# EAGLE schematic GEVCU-6-2c (EAGLE 6.6.0)
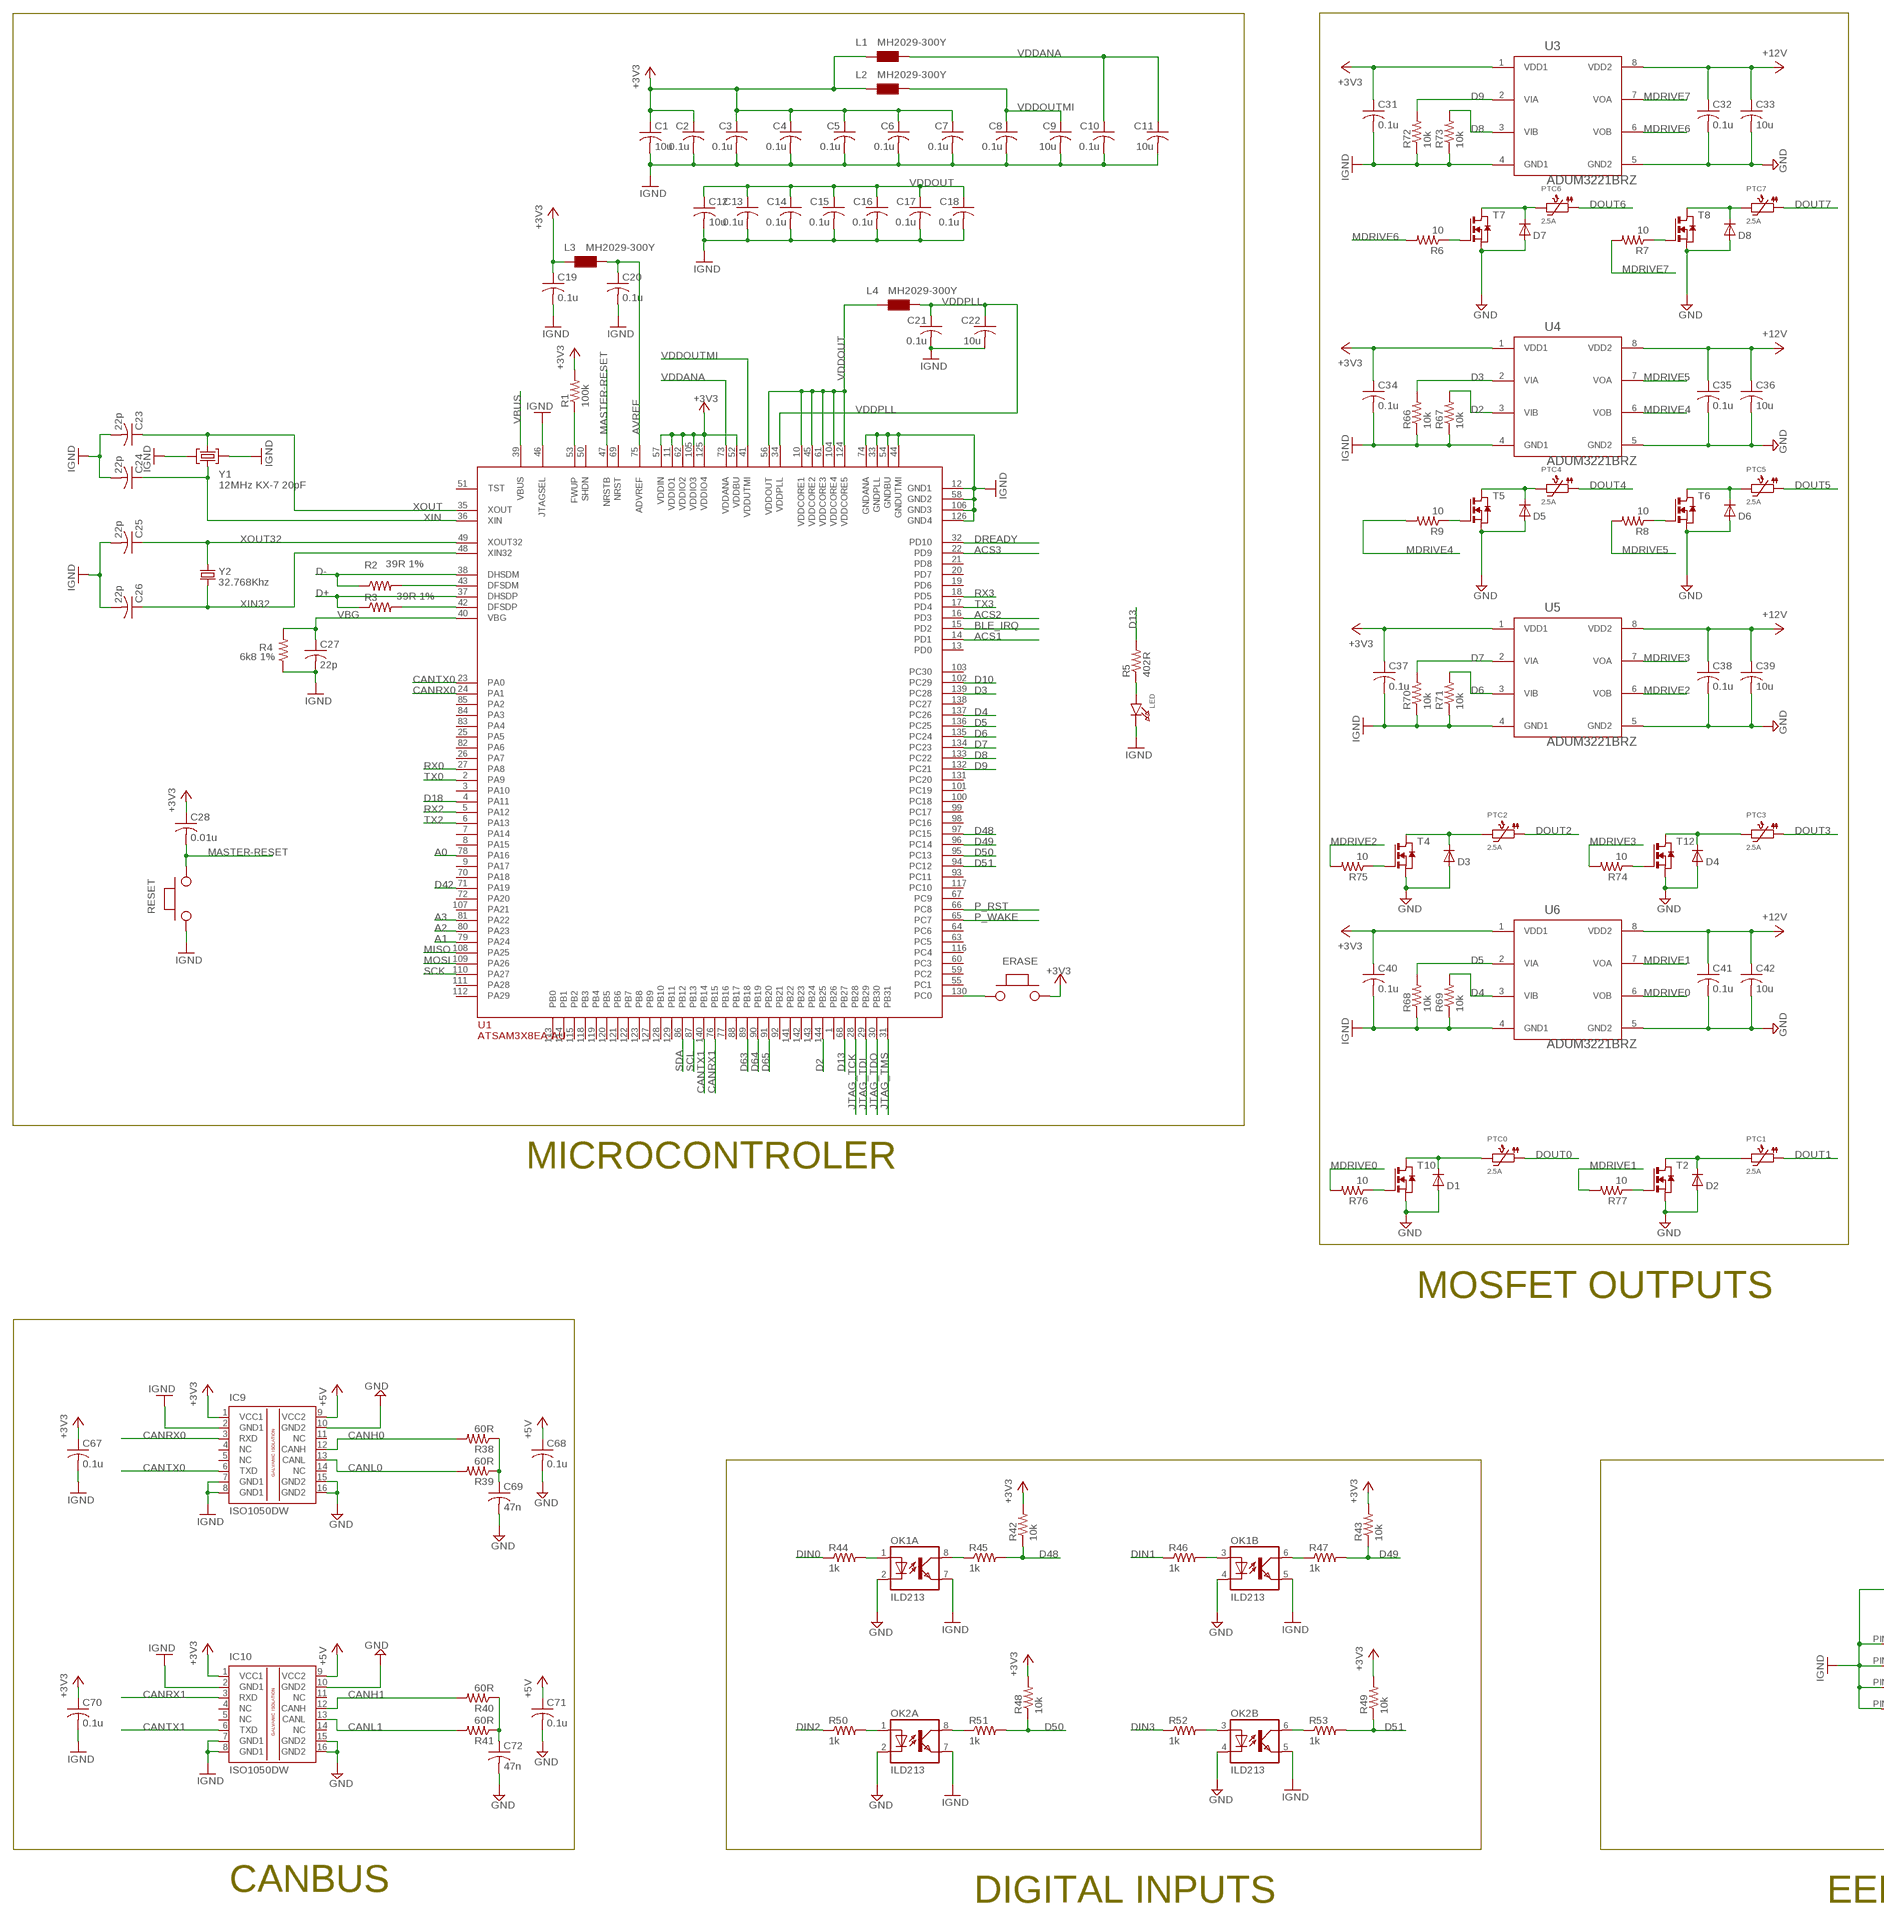
[diagram p0: schematic, sheet 1, part 1 of 2]
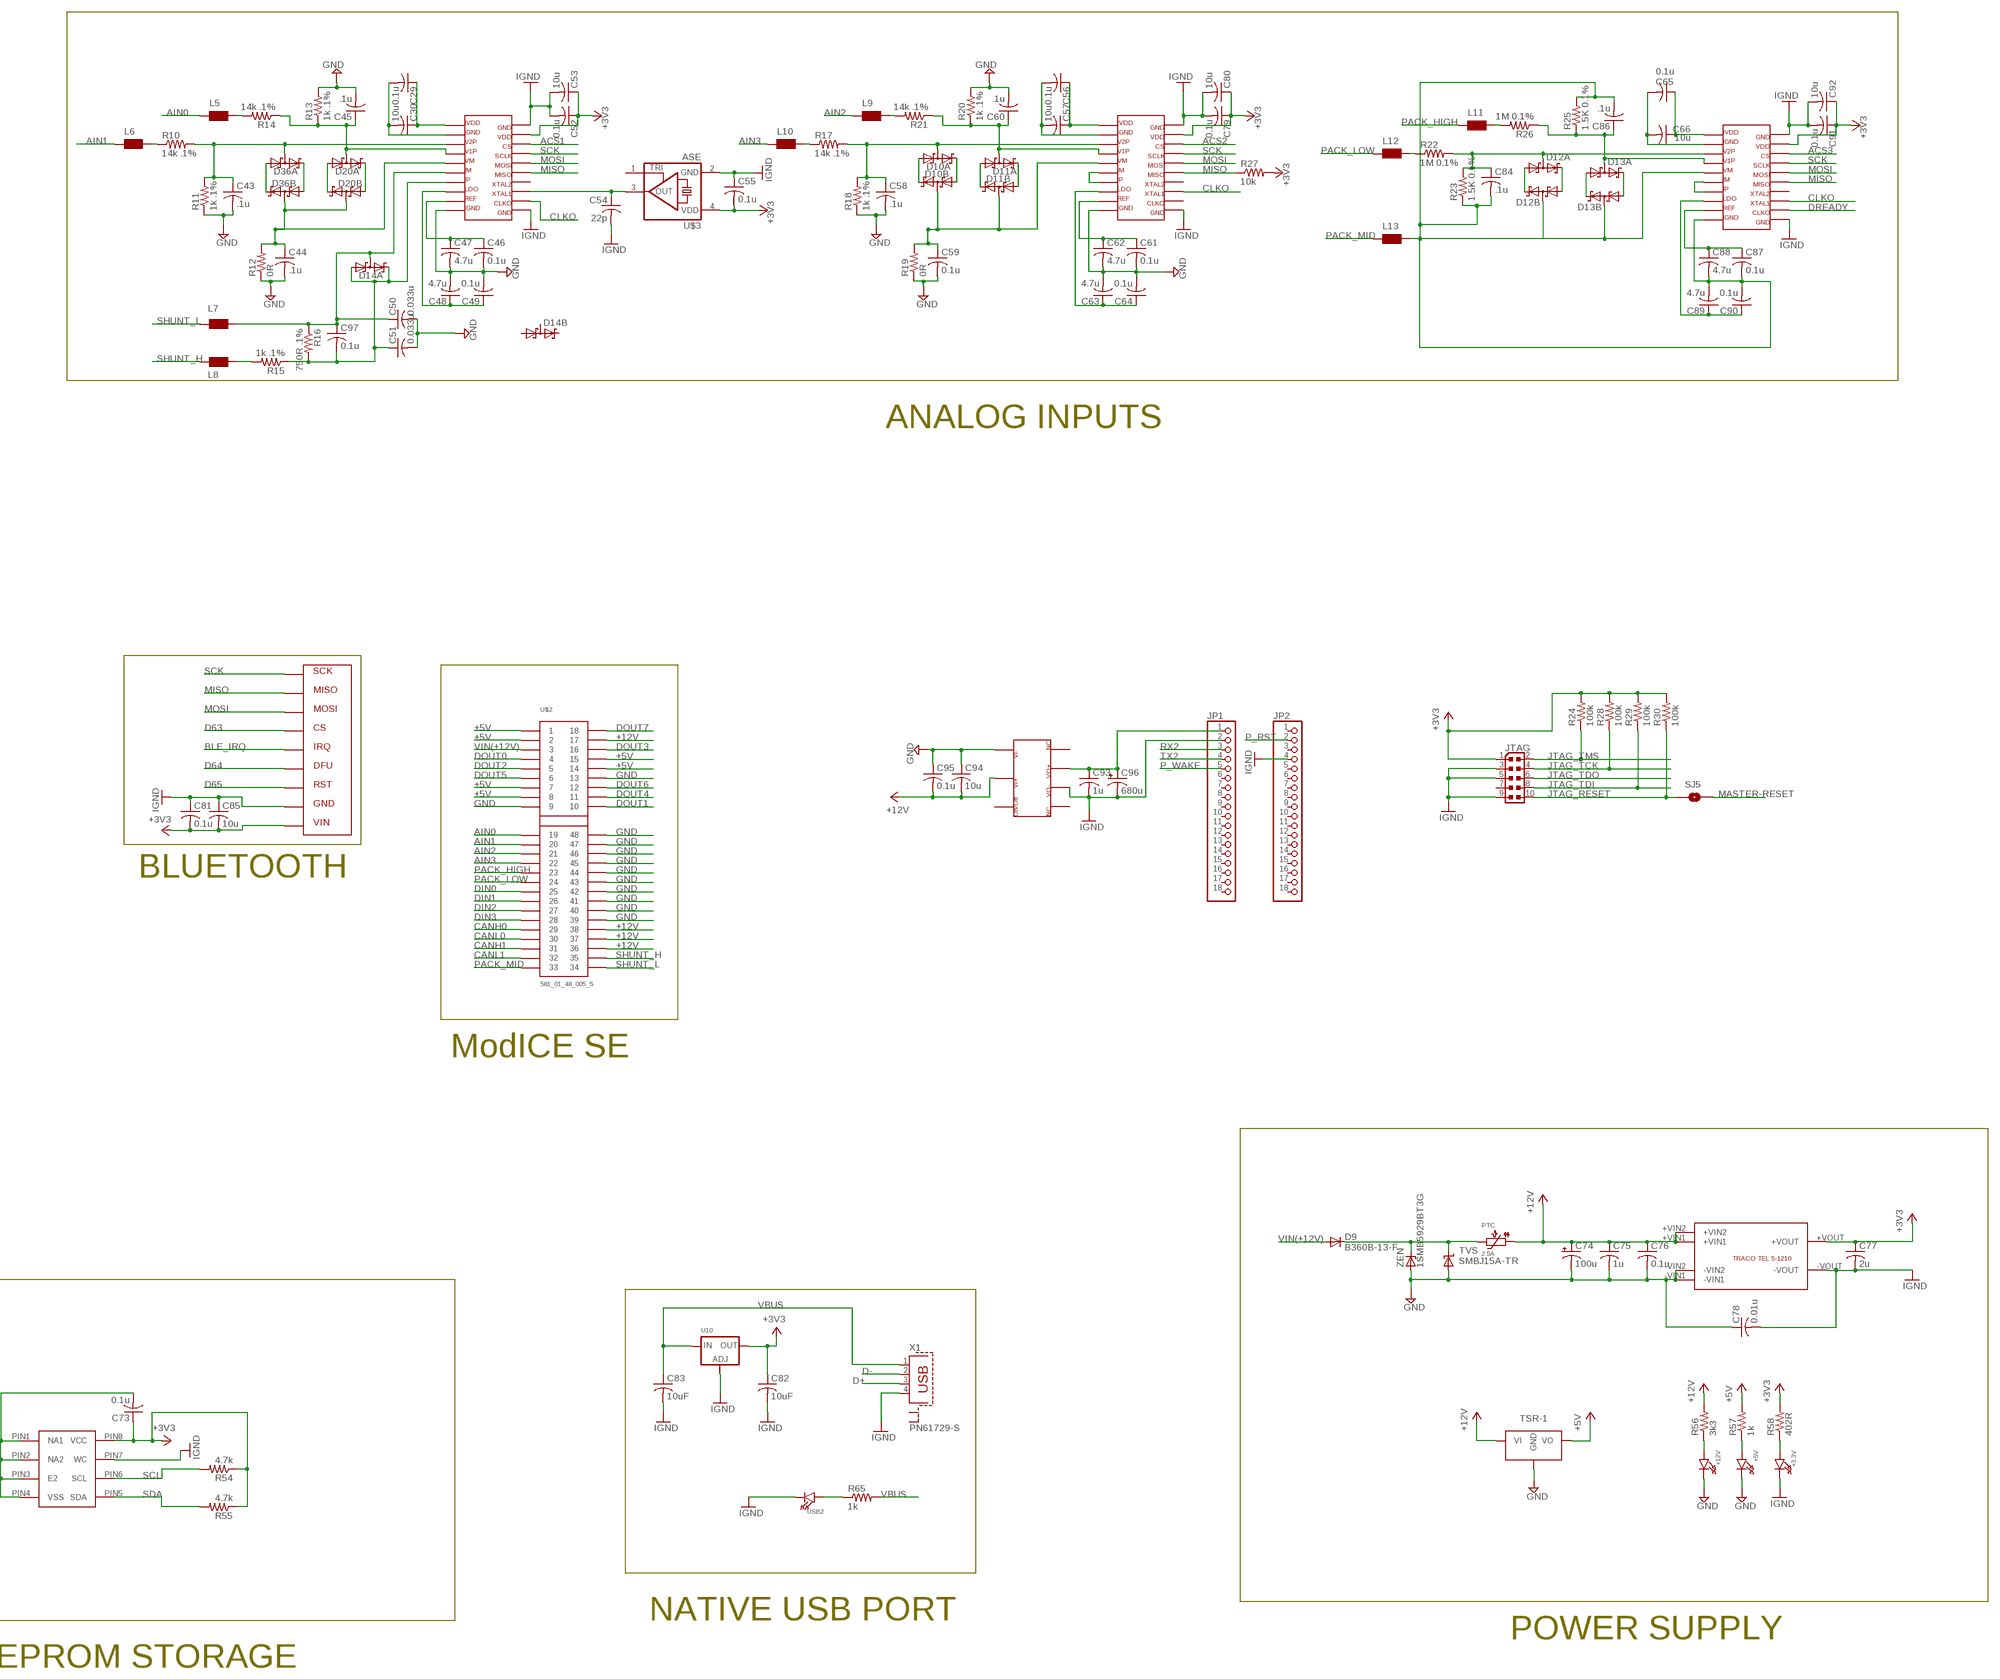
[diagram p1: schematic, sheet 1, part 2 of 2]

## Parts
+3.3V  LED0805  [CHIPLED_0805]
+5V  LED0805  [CHIPLED_0805]
+12V  LED0805  [CHIPLED_0805]
C1  10u  C-USC0805  [C0805]
C2  0.1u  C-USC0805  [C0805]
C3  0.1u  C-USC0805  [C0805]
C4  0.1u  C-USC0805  [C0805]
C5  0.1u  C-USC0805  [C0805]
C6  0.1u  C-USC0805  [C0805]
C7  0.1u  C-USC0805  [C0805]
C8  0.1u  C-USC0805  [C0805]
C9  10u  C-USC0805  [C0805]
C10  0.1u  C-USC0805  [C0805]
C11  10u  C-USC0805  [C0805]
C12  10u  C-USC0805  [C0805]
C13  0.1u  C-USC0805  [C0805]
C14  0.1u  C-USC0805  [C0805]
C15  0.1u  C-USC0805  [C0805]
C16  0.1u  C-USC0805  [C0805]
C17  0.1u  C-USC0805  [C0805]
C18  0.1u  C-USC0805  [C0805]
C19  0.1u  C-USC0805  [C0805]
C20  0.1u  C-USC0805  [C0805]
C21  0.1u  C-USC0805  [C0805]
C22  10u  C-USC0805  [C0805]
C23  22p  C-USC1206  [C1206]
C24  22p  C-USC1206  [C1206]
C25  22p  C-USC0805  [C0805]
C26  22p  C-USC0805  [C0805]
C27  22p  C-USC0805  [C0805]
C28  0.01u  C-USC0805  [C0805]
C29  0.1u  C-USC0805  [C0805]
C30  10u  C-USC0805  [C0805]
C31  0.1u  C-USC0805  [C0805]
C32  0.1u  C-USC0805  [C0805]
C33  10u  C-USC0805  [C0805]
C34  0.1u  C-USC0805  [C0805]
C35  0.1u  C-USC0805  [C0805]
C36  10u  C-USC0805  [C0805]
C37  0.1u  C-USC0805  [C0805]
C38  0.1u  C-USC0805  [C0805]
C39  10u  C-USC0805  [C0805]
C40  0.1u  C-USC0805  [C0805]
C41  0.1u  C-USC0805  [C0805]
C42  10u  C-USC0805  [C0805]
C43  .1u  C-USC0805  [C0805]
C44  .1u  C-USC0805  [C0805]
C45  .1u  C-USC0805  [C0805]
C46  0.1u  C-USC0805  [C0805]
C47  4.7u  C-USC0805  [C0805]
C48  4.7u  C-USC0805  [C0805]
C49  0.1u  C-USC0805  [C0805]
C50  0.033u  C-USC0805  [C0805]
C51  0.033u  C-USC0805  [C0805]
C52  0.1u  C-USC0805  [C0805]
C53  10u  C-USC0805  [C0805]
C54  22p  C-USC1206  [C1206]
C55  0.1u  C-USC0805  [C0805]
C56  0.1u  C-USC0805  [C0805]
C57  10u  C-USC0805  [C0805]
C58  .1u  C-USC0805  [C0805]
C59  0.1u  C-USC0805  [C0805]
C60  .1u  C-USC0805  [C0805]
C61  0.1u  C-USC0805  [C0805]
C62  4.7u  C-USC0805  [C0805]
C63  4.7u  C-USC0805  [C0805]
C64  0.1u  C-USC0805  [C0805]
C65  0.1u  C-USC0805  [C0805]
C66  10u  C-USC0805  [C0805]
C67  0.1u  C-USC0805  [C0805]
C68  0.1u  C-USC0805  [C0805]
C69  47n  C-USC0805  [C0805]
C70  0.1u  C-USC0805  [C0805]
C71  0.1u  C-USC0805  [C0805]
C72  47n  C-USC0805  [C0805]
C73  0.1u  C-USC0805  [C0805]
C74  100u  CPOL-USE2.5-6  [E2,5-6]
C75  1u  C-USC0805  [C0805]
C76  0.1u  C-USC0805  [C0805]
C77  2u  C-USC0805  [C0805]
C78  0.01u  C-USC1812  [C1812]
C79  0.1u  C-USC0805  [C0805]
C80  10u  C-USC0805  [C0805]
C81  0.1u  C-USC0805  [C0805]
C82  10uF  C-USC0805  [C0805]
C83  10uF  C-USC0805  [C0805]
C84  .1u  C-USC0805  [C0805]
C85  10u  C-USC0805  [C0805]
C86  .1u  C-USC0805  [C0805]
C87  0.1u  C-USC0805  [C0805]
C88  4.7u  C-USC0805  [C0805]
C89  4.7u  C-USC0805  [C0805]
C90  0.1u  C-USC0805  [C0805]
C91  0.1u  C-USC0805  [C0805]
C92  10u  C-USC0805  [C0805]
C93  1u  C-USC0805  [C0805]
C94  10u  C-USC0805  [C0805]
C95  0.1u  C-USC0805  [C0805]
C96  680u  CPOL-USE5-10.5  [E5-10,5]
C97  0.1u  C-USC0805  [C0805]
D1  MBR0520LT  [SOD123]
D2  MBR0520LT  [SOD123]
D3  MBR0520LT  [SOD123]
D4  MBR0520LT  [SOD123]
D5  MBR0520LT  [SOD123]
D6  MBR0520LT  [SOD123]
D7  MBR0520LT  [SOD123]
D8  MBR0520LT  [SOD123]
D9  B360B-13-F  DIODE-SMB  [SMB]
D10  BAS70XY  [SOT363_PHILIPS]
D11  BAS70XY  [SOT363_PHILIPS]
D12  BAS70XY  [SOT363_PHILIPS]
D13  BAS70XY  [SOT363_PHILIPS]
D14  BAS70XY  [SOT363_PHILIPS]
D20  BAS70XY  [SOT363_PHILIPS]
D36  BAS70XY  [SOT363_PHILIPS]
ERASE  PUCHBUTTON  [PUCHBUTTON]
IC9  ISO1050DW  ISO1050DUB  [DUB-R-PDSO-G8]
IC10  ISO1050DW  ISO1050DUB  [DUB-R-PDSO-G8]
JP1  PINHD-1X18  [1X18]
JP2  PINHD-1X18  [1X18]
JTAG  PINHEAD_PINHD-2X5PASSO127  [PINHEAD_2X05_127]
L1  MH2029-300Y  WE-CBF_0805  [0805]
L2  MH2029-300Y  WE-CBF_0805  [0805]
L3  MH2029-300Y  WE-CBF_0805  [0805]
L4  MH2029-300Y  WE-CBF_0805  [0805]
L5  MH2029-300Y  WE-CBF_0805  [0805]
L6  MH2029-300Y  WE-CBF_0805  [0805]
L7  MH2029-300Y  WE-CBF_0805  [0805]
L8  MH2029-300Y  WE-CBF_0805  [0805]
L9  MH2029-300Y  WE-CBF_0805  [0805]
L10  MH2029-300Y  WE-CBF_0805  [0805]
L11  MH2029-300Y  WE-CBF_0805  [0805]
L12  MH2029-300Y  WE-CBF_0805  [0805]
L13  MH2029-300Y  WE-CBF_0805  [0805]
LED  LED0805  [CHIPLED_0805]
OK1  ILD213  [SOIC08]
OK2  ILD213  [SOIC08]
PTC  2.5A  PTC1812  [PTC1812]
PTC0  2.5A  PTC1812  [PTC1812]
PTC1  2.5A  PTC1812  [PTC1812]
PTC2  2.5A  PTC1812  [PTC1812]
PTC3  2.5A  PTC1812  [PTC1812]
PTC4  2.5A  PTC1812  [PTC1812]
PTC5  2.5A  PTC1812  [PTC1812]
PTC6  2.5A  PTC1812  [PTC1812]
PTC7  2.5A  PTC1812  [PTC1812]
R1  100k  R-US_R0805  [R0805]
R2  39R 1%  R-US_R0805  [R0805]
R3  39R 1%  R-US_R0805  [R0805]
R4  6k8 1%  R-US_R0805  [R0805]
R5  402R  R-US_R0805  [R0805]
R6  10  R-US_R0805  [R0805]
R7  10  R-US_R0805  [R0805]
R8  10  R-US_R0805  [R0805]
R9  10  R-US_R0805  [R0805]
R10  14k .1%  R-US_R0805  [R0805]
R11  1k .1%  R-US_R0805  [R0805]
R12  0R  R-US_R0805  [R0805]
R13  1k .1%  R-US_R0805  [R0805]
R14  14k .1%  R-US_R0805  [R0805]
R15  1k .1%  R-US_R0805  [R0805]
R16  750R .1%  R-US_R0805  [R0805]
R17  14k .1%  R-US_R0805  [R0805]
R18  1k .1%  R-US_R0805  [R0805]
R19  0R  R-US_R0805  [R0805]
R20  1k .1%  R-US_R0805  [R0805]
R21  14k .1%  R-US_R0805  [R0805]
R22  1M 0.1%  R-US_R1206  [R1206]
R23  1.5K 0.1%  R-US_R0805  [R0805]
R24  100k  R-US_R0805  [R0805]
R25  1.5K 0.1%  R-US_R0805  [R0805]
R26  1M 0.1%  R-US_R1206  [R1206]
R27  10k  R-US_R0805  [R0805]
R28  100k  R-US_R0805  [R0805]
R29  100k  R-US_R0805  [R0805]
R30  100k  R-US_R0805  [R0805]
R38  60R  R-US_R0805  [R0805]
R39  60R  R-US_R0805  [R0805]
R40  60R  R-US_R0805  [R0805]
R41  60R  R-US_R0805  [R0805]
R42  10k  R-US_R0805  [R0805]
R43  10k  R-US_R0805  [R0805]
R44  1k  R-US_R0805  [R0805]
R45  1k  R-US_R0805  [R0805]
R46  1k  R-US_R0805  [R0805]
R47  1k  R-US_R0805  [R0805]
R48  10k  R-US_R0805  [R0805]
R49  10k  R-US_R0805  [R0805]
R50  1k  R-US_R0805  [R0805]
R51  1k  R-US_R0805  [R0805]
R52  1k  R-US_R0805  [R0805]
R53  1k  R-US_R0805  [R0805]
R54  4.7k  R-US_R0805  [R0805]
R55  4.7k  R-US_R0805  [R0805]
R56  3k3  R-US_R0805  [R0805]
R57  1k  R-US_R0805  [R0805]
R58  402R  R-US_R0805  [R0805]
R65  1k  R-US_R0805  [R0805]
R66  10k  R-US_R0805  [R0805]
R67  10k  R-US_R0805  [R0805]
R68  10k  R-US_R0805  [R0805]
R69  10k  R-US_R0805  [R0805]
R70  10k  R-US_R0805  [R0805]
R71  10k  R-US_R0805  [R0805]
R72  10k  R-US_R0805  [R0805]
R73  10k  R-US_R0805  [R0805]
R74  10  R-US_R0805  [R0805]
R75  10  R-US_R0805  [R0805]
R76  10  R-US_R0805  [R0805]
R77  10  R-US_R0805  [R0805]
RESET  PUCHBUTTON  [PUCHBUTTON]
SJ5  SOLDERJUMPERNO  [SJ_2S-NO]
T2  NMOSSOT223  [SOT223]
T4  NMOSSOT223  [SOT223]
T5  NMOSSOT223  [SOT223]
T6  NMOSSOT223  [SOT223]
T7  NMOSSOT223  [SOT223]
T8  NMOSSOT223  [SOT223]
T10  NMOSSOT223  [SOT223]
T12  NMOSSOT223  [SOT223]
TVS  SMBJ15A-TR  SUPPRESSOR-SMBJ  [SMBJ]
U1  ATSAM3X8EA-AU  ATSAM3X/AAU  [LQFP144]
U3  ADUM3221BRZ  [SOIC127P600X175-8N]
U4  ADUM3221BRZ  [SOIC127P600X175-8N]
U5  ADUM3221BRZ  [SOIC127P600X175-8N]
U6  ADUM3221BRZ  [SOIC127P600X175-8N]
U7  CK_CUSTOM_M24M02-DRMN6TP  [CK_CUSTOM_SOIC8]
U8  TRACO  [TRACO]
U9  TSR-1  [TSR-1]
U10  LM1117SOT223-WAVE  [SOT223-W]
U11  ADE7913  [SOIC20]
U12  ADE7913  [SOIC20]
U24  ADE7913  [SOIC20]
U$1  CINCON5V  [CINCON5V]
U$2  581_01_48_005_S  [581_01_48_005_S]
U$3  ASE  [ASE]
U$4  BLE_SPI  [BLE_SPI]
USB2  LED0805  [CHIPLED_0805]
X1  PN61729-S  [PN61729-S]
Y1  12MHz KX-7 20pF  CRYSTAL-3.2-2.5  [CRYSTAL-3.2-2.5]
Y2  32.768Khz  ARDUINO_WIFI_SHIELD_V018_TG_RESONATOR_EPSON_FC_145  [ARDUINO_WIFI_SHIELD_V018_TG_RESONATOR_EPSON_FC_145]
ZEN  1SMB5929BT3G  ZENER-DIODESMB  [SMB]

## Nets
+3V3: C1.1 C2.1 C3.1 C4.1 C5.1 C6.1 C7.1 C19.1 C28.1 C31.1 C34.1 C37.1 C40.1 C52.1 C53.1 C55.2 C67.1 C70.1 C73.1 C77.1 C79.1 C80.1 C81.2 C82.1 C85.2 C91.1 C92.1 ERASE.P$2 IC9.1(VCC1) IC10.1(VCC1) JTAG.1 L1.1 L2.1 L3.1 R1.2 R24.2 R27.2 R28.2 R29.2 R30.2 R42.2 R43.2 R48.2 R49.2 R54.1 R55.1 R58.2 U1.11(VDDIO1) U1.52(VDDBU) U1.57(VDDIN) U1.62(VDDIO2) U1.105(VDDIO3) U1.125(VDDIO4) U3.1(VDD1) U4.1(VDD1) U5.1(VDD1) U6.1(VDD1) U7.PIN8(VCC) U8.+VOUT U10.2(OUT) U11.19 U12.19 U24.19 U$3.4(VDD) U$4.P$9
+5V: C68.1 C71.1 IC9.9(VCC2) IC10.9(VCC2) R57.2 U9.P$3(VO) U$2.P$1 U$2.P$2 U$2.P$7 U$2.P$8 U$2.P$14 U$2.P$15
+12V: C32.1 C33.1 C35.1 C36.1 C38.1 C39.1 C41.1 C42.1 C74.+ C75.1 C76.1 C94.2 C95.2 PTC.P$1 R56.2 U3.8(VDD2) U4.8(VDD2) U5.8(VDD2) U6.8(VDD2) U8.+VIN1 U8.+VIN2 U9.P$1(VI) U$1.P$2 U$2.P$17 U$2.P$36 U$2.P$37 U$2.P$38
A0: U1.78(PA16)
A1: U1.79(PA24)
A2: U1.80(PA23)
A3: U1.81(PA22)
ACS1: U1.14(PD1) U11.18
ACS2: U1.16(PD3) U12.18
ACS3: U1.22(PD9) U24.18
AIN0: L5.1 U$2.P$19
AIN1: L6.1 U$2.P$20
AIN2: L9.1 U$2.P$21
AIN3: L10.1 U$2.P$22
AVREF: C20.1 L3.2 U1.75(ADVREF)
BLE_IRQ: U1.15(PD2) U$4.P$5
CANH0: IC9.12(CANH) R38.2 U$2.P$29
CANH1: IC10.12(CANH) R40.2 U$2.P$31
CANL0: IC9.13(CANL) R39.2 U$2.P$30
CANL1: IC10.13(CANL) R41.2 U$2.P$32
CANRX0: IC9.3(RXD) U1.24(PA1)
CANRX1: IC10.3(RXD) U1.76(PB15)
CANTX0: IC9.6(TXD) U1.23(PA0)
CANTX1: IC10.6(TXD) U1.140(PB14)
CLKO: U11.12 U12.13 U24.13
D2: R67.2 U1.144(PB25) U4.3(VIB)
D3: R66.2 U1.139(PC28) U4.2(VIA)
D4: R69.2 U1.137(PC26) U6.3(VIB)
D5: R68.2 U1.136(PC25) U6.2(VIA)
D6: R71.2 U1.135(PC24) U5.3(VIB)
D7: R70.2 U1.134(PC23) U5.2(VIA)
D8: R73.2 U1.133(PC22) U3.3(VIB)
D9: R72.2 U1.132(PC21) U3.2(VIA)
D10: U1.102(PC29)
D13: R5.2 U1.68(PB27)
D18: U1.4(PA11)
D42: U1.71(PA19)
D48: R42.1 R45.2 U1.97(PC15)
D49: R43.1 R47.2 U1.96(PC14)
D50: R48.1 R51.2 U1.95(PC13)
D51: R49.1 R53.2 U1.94(PC12)
D63: U1.89(PB18) U$4.P$4
D64: U1.90(PB19) U$4.P$6
D65: U1.91(PB20) U$4.P$7
D+ [USB]: R3.1 U1.37(DHSDP) X1.3
D- [USB]: R2.1 U1.38(DHSDM) X1.2
DIN0: R44.1 U$2.P$25
DIN1: R46.1 U$2.P$26
DIN2: R50.1 U$2.P$27
DIN3: R52.1 U$2.P$28
DOUT0: PTC0.P$1 U$2.P$4
DOUT1: PTC1.P$1 U$2.P$10
DOUT2: PTC2.P$1 U$2.P$5
DOUT3: PTC3.P$1 U$2.P$16
DOUT4: PTC4.P$1 U$2.P$11
DOUT5: PTC5.P$1 U$2.P$6
DOUT6: PTC6.P$1 U$2.P$12
DOUT7: PTC7.P$1 U$2.P$18
DREADY: U1.32(PD10) U24.12
ERASE_S: ERASE.P$1 U1.130(PC0)
GND: +5V.C +12V.C C32.2 C33.2 C35.2 C36.2 C38.2 C39.2 C41.2 C42.2 C43.2 C44.2 C45.2 C46.2 C47.2 C48.2 C49.2 C50.2 C51.2 C58.2 C59.2 C60.2 C61.2 C62.2 C63.2 C64.2 C68.2 C69.2 C71.2 C72.2 C74.- C75.2 C76.2 C78.1 C94.1 C95.1 D1.A D2.A D3.A D4.A D5.A D6.A D7.A D8.A IC9.10(GND2) IC9.15(GND2) IC9.16(GND2) IC10.10(GND2) IC10.15(GND2) IC10.16(GND2) OK1.2(A:C) OK1.4(B:C) OK2.2(A:C) OK2.4(B:C) R11.1 R12.1 R13.2 R18.1 R19.1 R20.2 T2.3(S) T4.3(S) T5.3(S) T6.3(S) T7.3(S) T8.3(S) T10.3(S) T12.3(S) TVS.A U3.5(GND2) U4.5(GND2) U5.5(GND2) U6.5(GND2) U8.-VIN1 U8.-VIN2 U9.P$2(GND) U11.10 U12.10 U$1.P$1 U$2.P$9 U$2.P$13 U$2.P$39 U$2.P$40 U$2.P$41 U$2.P$42 U$2.P$43 U$2.P$44 U$2.P$45 U$2.P$46 U$2.P$47 U$2.P$48 ZEN.A
IGND: +3.3V.C C1.2 C2.2 C3.2 C4.2 C5.2 C6.2 C7.2 C8.2 C9.2 C10.2 C11.2 C12.2 C13.2 C14.2 C15.2 C16.2 C17.2 C18.2 C19.2 C20.2 C21.2 C22.2 C23.2 C24.2 C25.2 C26.2 C27.2 C31.2 C34.2 C37.2 C40.2 C52.2 C53.2 C54.2 C55.1 C67.2 C70.2 C73.2 C77.2 C78.2 C79.2 C80.2 C81.1 C82.2 C83.2 C85.1 C91.2 C92.2 C93.2 C96.- IC9.2(GND1) IC9.7(GND1) IC9.8(GND1) IC10.2(GND1) IC10.7(GND1) IC10.8(GND1) JP1.2 JP2.4 JTAG.3 JTAG.5 JTAG.9 LED.C OK1.5(B:EMIT) OK1.7(A:EMIT) OK2.5(B:EMIT) OK2.7(A:EMIT) R4.1 R66.1 R67.1 R68.1 R69.1 R70.1 R71.1 R72.1 R73.1 RESET.P$1 U1.12(GND1) U1.33(GNDPLL) U1.44(GNDUTMI) U1.46(JTAGSEL) U1.54(GNDBU) U1.58(GND2) U1.74(GNDANA) U1.106(GND3) U1.126(GND4) U3.4(GND1) U4.4(GND1) U5.4(GND1) U6.4(GND1) U7.PIN1(NA1) U7.PIN2(NA2) U7.PIN3(E2) U7.PIN4(VSS) U7.PIN7(WC) U8.-VOUT U10.1(ADJ) U11.11 U11.20 U12.11 U12.20 U24.11 U24.20 U$1.P$6 U$3.2(GND) U$4.P$8 USB2.C X1.4 Y1.2(GND) Y1.4(GND)
JTAG_RESET: JTAG.10 R30.1 SJ5.1
JTAG_TCK: JTAG.4 R28.1 U1.28(PB28)
JTAG_TDI: JTAG.8 R29.1 U1.29(PB29)
JTAG_TDO: JTAG.6 U1.30(PB30)
JTAG_TMS: JTAG.2 R24.1 U1.31(PB31)
MASTER-RESET: C28.2 RESET.P$2 SJ5.2 U1.47(NRSTB)
MDRIVE0: R76.2 U6.6(VOB)
MDRIVE1: R77.2 U6.7(VOA)
MDRIVE2: R75.2 U5.6(VOB)
MDRIVE3: R74.2 U5.7(VOA)
MDRIVE4: R9.2 U4.6(VOB)
MDRIVE5: R8.2 U4.7(VOA)
MDRIVE6: R6.2 U3.6(VOB)
MDRIVE7: R7.2 U3.7(VOA)
MISO: R27.1 U1.108(PA25) U11.15 U12.15 U24.15 U$4.P$2
MOSI: U1.109(PA26) U11.16 U12.16 U24.16 U$4.P$3
N$1: D36.1(A:A1) D36.5(B:C2)
N$2: +3.3V.A R58.1
N$3: D9.C PTC.P$2 TVS.C ZEN.C
N$4: +5V.A R57.1
N$5: C29.1 C30.1 U11.1
N$6: LED.A R5.1
N$7: L8.1 R15.2
N$8: D36.2(A:C2) D36.4(B:A1)
N$9: C45.1 D20.6(A:C1A2) R13.1 R14.1 U11.4
N$10: C29.2 C30.2 U11.2
N$11: C43.1 D36.6(A:C1A2) R10.2 R11.2 U11.3
N$12: L5.2 R14.2
N$13: C44.1 D20.3(B:C1A2) D36.3(B:C1A2) R12.2 U11.5
N$14: C65.1 C66.1 U24.1
N$15: C46.1 C47.1 U11.9
N$16: C48.1 C49.1 U11.8
N$17: L6.2 R10.1
N$18: D20.1(A:A1) D20.5(B:C2)
N$19: D20.2(A:C2) D20.4(B:A1)
N$21: C51.1 C97.2 D14.1(A:A1) D14.2(A:C2) R15.1 R16.2 U11.7
N$22: C50.1 C97.1 D14.6(A:C1A2) L7.1 R16.1 U11.6
N$23: C56.1 C57.1 U12.1
N$24: C69.1 R38.1 R39.1
N$29: C72.1 R40.1 R41.1
N$31: OK1.1(A:A) R44.2
N$32: OK1.3(B:A) R46.2
N$33: OK1.8(A:COL) R45.1
N$34: OK1.6(B:COL) R47.1
N$35: C56.2 C57.2 U12.2
N$36: OK2.6(B:COL) R53.1
N$37: D10.1(A:A1) D10.5(B:C2)
N$38: OK2.8(A:COL) R51.1
N$39: C65.2 C66.2 U24.2
N$40: OK2.1(A:A) R50.2
N$41: C54.1 U11.13 U$3.3(OUT)
N$43: OK2.3(B:A) R52.2
N$44: +12V.A R56.1
N$45: D10.2(A:C2) D10.4(B:A1)
N$48: D2.C PTC1.P$2 T2.2(D) T2.4(D)
N$49: C58.1 D10.6(A:C1A2) R17.2 R18.2 U12.3
N$50: D11.1(A:A1) D11.5(B:C2)
N$51: D3.C PTC2.P$2 T4.2(D) T4.4(D)
N$52: D11.2(A:C2) D11.4(B:A1)
N$53: R2.2 U1.43(DFSDM)
N$54: C59.1 D10.3(B:C1A2) D11.3(B:C1A2) R19.2 U12.5
N$55: C60.1 D11.6(A:C1A2) R20.1 R21.1 U12.4
N$56: R3.2 U1.42(DFSDP)
N$57: D5.C PTC4.P$2 T5.2(D) T5.4(D)
N$58: D6.C PTC5.P$2 T6.2(D) T6.4(D)
N$59: R1.1 U1.53(FWUP)
N$60: D7.C PTC6.P$2 T7.2(D) T7.4(D)
N$61: D8.C PTC7.P$2 T8.2(D) T8.4(D)
N$62: D4.C PTC3.P$2 T12.2(D) T12.4(D)
N$63: D1.C PTC0.P$2 T10.2(D) T10.4(D)
N$64: D12.1(A:A1) D12.5(B:C2)
N$65: C61.1 C62.1 U12.9
N$66: R65.1 USB2.A
N$69: R6.1 T7.1(G)
N$70: R76.1 T10.1(G)
N$72: R77.1 T2.1(G)
N$74: R74.1 T12.1(G)
N$77: R75.1 T4.1(G)
N$78: R9.1 T5.1(G)
N$80: R8.1 T6.1(G)
N$81: R7.1 T8.1(G)
N$82: C63.1 C64.1 U12.8
N$83: L9.2 R21.2
N$84: L10.2 R17.1
N$85: U12.6 U12.7
N$87: D12.2(A:C2) D12.4(B:A1)
N$89: C84.1 D12.6(A:C1A2) R22.2 R23.2 U24.3
N$91: D13.1(A:A1) D13.5(B:C2)
N$92: D13.2(A:C2) D13.4(B:A1)
N$98: D13.3(B:C1A2) U24.5
N$100: C86.1 D13.6(A:C1A2) R25.1 R26.1 U24.4
N$101: C87.1 C88.1 U24.9
N$102: C89.1 C90.1 U24.8
N$103: L11.2 R26.2
N$104: L12.2 R22.1
N$105: U24.6 U24.7
N$107: C93.1 C96.+ JP1.1 U$1.P$5
N$110: C84.2 C86.2 C87.2 C88.2 C89.2 C90.2 D12.3(B:C1A2) L13.2 R23.1 R25.2 U24.10
P_RST: JP2.2 U1.66(PC8)
P_WAKE: JP1.5 U1.65(PC7)
PACK_HIGH: L11.1 U$2.P$23
PACK_LOW: L12.1 U$2.P$24
PACK_MID: L13.1 U$2.P$33
RX0: U1.27(PA8)
RX2: JP1.3 U1.5(PA12)
RX3: U1.18(PD5)
SCK: U1.110(PA27) U11.17 U12.17 U24.17 U$4.P$1
SCL: R54.2 U1.87(PB13) U7.PIN6(SCL)
SDA: R55.2 U1.86(PB12) U7.PIN5(SDA)
SHUNT_H: L8.2 U$2.P$35
SHUNT_L: L7.2 U$2.P$34
TX0: U1.2(PA9)
TX2: JP1.4 U1.6(PA13)
TX3: U1.17(PD4)
VBG: C27.1 R4.2 U1.40(VBG)
VBUS: C83.1 R65.2 U1.39(VBUS) U10.3(IN) X1.1
VDDANA: C10.1 C11.1 L1.2 U1.73(VDDANA)
VDDOUT: C12.1 C13.1 C14.1 C15.1 C16.1 C17.1 C18.1 L4.1 U1.10(VDDCORE1) U1.45(VDDCORE2) U1.56(VDDOUT) U1.61(VDDCORE3) U1.104(VDDCORE4) U1.124(VDDCORE5)
VDDOUTMI: C8.1 C9.1 L2.2 U1.41(VDDUTMI)
VDDPLL: C21.1 C22.1 L4.2 U1.34(VDDPLL)
VIN(+12V): D9.A U$2.P$3
XIN: C24.1 U1.36(XIN) Y1.1(C1)
XIN32: C26.1 U1.48(XIN32) Y2.P$2
XOUT: C23.1 U1.35(XOUT) Y1.3(C2)
XOUT32: C25.1 U1.49(XOUT32) Y2.P$1
Unconnected: D14.3(B:C1A2) D14.4(B:A1) D14.5(B:C2) IC9.4(NC) IC9.5(NC) IC9.11(NC) IC9.14(NC) IC10.4(NC) IC10.5(NC) IC10.11(NC) IC10.14(NC) JP1.6 JP1.7 JP1.8 JP1.9 JP1.10 JP1.11 JP1.12 JP1.13 JP1.14 JP1.15 JP1.16 JP1.17 JP1.18 JP2.1 JP2.3 JP2.5 JP2.6 JP2.7 JP2.8 JP2.9 JP2.10 JP2.11 JP2.12 JP2.13 JP2.14 JP2.15 JP2.16 JP2.17 JP2.18 JTAG.7 U1.1(PB26) U1.3(PA10) U1.7(PA14) U1.8(PA15) U1.9(PA17) U1.13(PD0) U1.19(PD6) U1.20(PD7) U1.21(PD8) U1.25(PA5) U1.26(PA7) U1.50(SHDN) U1.51(TST) U1.55(PC1) U1.59(PC2) U1.60(PC3) U1.63(PC5) U1.64(PC6) U1.67(PC9) U1.69(NRST) U1.70(PA18) U1.72(PA20) U1.77(PB16) U1.82(PA6) U1.83(PA4) U1.84(PA3) U1.85(PA2) U1.88(PB17) U1.92(PB21) U1.93(PC11) U1.98(PC16) U1.99(PC17) U1.100(PC18) U1.101(PC19) U1.103(PC30) U1.107(PA21) U1.111(PA28) U1.112(PA29) U1.113(PB0) U1.114(PB1) U1.115(PB2) U1.116(PC4) U1.117(PC10) U1.118(PB3) U1.119(PB4) U1.120(PB5) U1.121(PB6) U1.122(PB7) U1.123(PB8) U1.127(PB9) U1.128(PB10) U1.129(PB11) U1.131(PC20) U1.138(PC27) U1.141(PB22) U1.142(PB23) U1.143(PB24) U11.14 U12.12 U12.14 U24.14 U$1.P$3 U$1.P$4 U$1.P$7 U$3.1(TRI) X1.S1 X1.S2

## Notes on the sheet
- ANALOG INPUTS
- BLUETOOTH
- MICROCONTROLER
- ModICE SE
- MOSFET OUTPUTS
- NATIVE USB PORT
- POWER SUPPLY
- CANBUS | DIGITAL INPUTS | EEPROM STORAGE

## Library data of the parts
+3.3V +5V +12V LED USB2 = microbuilder:LED: LED 0603 - 0603 Surface Mount Package 2mA: Green LED - Low Power (3.9mcd, 2ma, 1.7Vf) - Digikey: 475-2709-2-ND Orange LED - Low Power (9.8mcd, 2ma, 1.8Vf) - Digikey: 475-1194-2-ND Red LED - Low Power (5mcd, 2ma, 1.8Vf) - Digikey: 475-1195-2-ND Yellow LED - Low Power (7mcd, 2ma, 1.8Vf) - Digikey: 475-1196-2-ND 5mA: Blue LED - Low Power (17mcd, 5ma, 2.9Vf) - Digikey: LNJ937W8CRACT-ND 0805 - 0805 Surface Mount Package 2mA: Red LED (8.8mcd, 2mA, 1.8Vf, Clear) - Low Power [Digikey: 475-2510-1-ND] Green LED (5mcd, 2mA, 1.8Vf, Clear) - Low Power [Digikey: 475-2730-1-ND] Yellow LED (11.3mcd, 2mA, 1.8Vf, Clear) - Low Power [Digikey: 475-2555-1-ND] 20mA: Red LED (104mcd, 20mA, Diffused) - LS R976 [Digikey: 475-1278-6-ND] Red LED (12mcd, 20mA, 2.0Vf, Clear) - APT2012EC [Digikey: 754-1128-1-ND] Green LED (15mcd, 20mA, 2.2Vf, Clear) - APT2012GC [Digikey: 754-1131-1-ND] Orange LED (160mcd, 20mA, 2.1Vf, Clear) - APT2012SECK [Digikey: 754-1130-1-ND] 1206 - 1206 Surface Mount Package Green LED (26mcd, 20mA, Diffused) - LG N971 [Digikey: 475-1407-6-ND] Red LED (15mcd, 20mA, Diffused) - LH N974 [Digikey: 475-1416-6-ND]
C1-C73 C75-C95 C97 = rcl:C-US: CAPACITOR, American symbol
C74 C96 = rcl:CPOL-US: POLARIZED CAPACITOR, American symbol
D1-D8 = diode:MBR0520LT: SCHOTTKY BARRIER RECTIFIER Source: http://onsemi.com .. MBR0520LT1-D.pdf
D9 = diode:DIODE-: DIODE
D10-D14 D20 D36 = diode:BAS70XY: Silicon Schottky Diodes General-purpose diode for high-speed switching Source: BAS70_1PS7XSB70_SER_8.pdf
ERASE = PushButton:PUCHBUTTON; BUTTON: ERASE; ERASE: Erase
IC9 IC10 = texas:ISO1050: ISOLATED CAN TRANSCEIVER Source: http://focus.ti.com/lit/ds/symlink/iso1050.pdf; MPN: ISO1050DW
JP1 JP2 = pinhead:PINHD-1X18: PIN HEADER
JTAG = Arduino_Wifi_shield_v018_tG:PINHEAD_PINHD-2X5: PIN HEADER
L1-L13 = wuerth-elektronik:WE-CBF: SMD EMI Suppression Ferrite Beads - excellent anti-EMI properties - low DCR - impedances till 3000 ohms - rated current up to 6 A
OK1 OK2 = optocoupler:ILD2*: Siemens ILD205/206/207/211/213/217 DUAL PHOTOTRANSISTOR SMALL OUTLINE SURFACE MOUNT OPTOCOUPLER Source: 153385-da-01-en-Optocoupler_ILD205-T.pdf; MF: VISHAY/TELEFUNKEN; MPN: ILD213T; OC_FARNELL: 1045451; OC_NEWARK: 20H8680
PTC PTC0 PTC1-PTC7 = microbuilder:PTC: PTC (Resettable Fuse) 1206 Package 250mA PTC (16V Max, Time-to-Trip: 0.08s) - Digikey: F2110CT-ND 1210 Package 100mA PTC (30V Max, Time-to-Trip: 0.6s) - Digikey: MF-USMF010-2CT-ND 1812 Package 750mA PTC (24V Max, Time-to-Trip: 0.2s) - Digikey: MF-MSMF075/24-2CT-ND
R1-R30 R38-R58 R65-R77 = rcl:R-US_: RESISTOR, American symbol
RESET = PushButton:PUCHBUTTON; BUTTON: RESET; RESET: RESET
SJ5 = SparkFun-Passives:SOLDERJUMPER: Solder Jumper Standard SMD solder jumper. Used to automate production. Two varients : Normally Open and Normally Closed are the same, but have different paste layers. NC will have a large amount of paste and should jumper during reflow.
T2 T4-T8 T10 T12 = zetex:NMOSSOT223: MOS FET; OC_FARNELL: unknown; OC_NEWARK: unknown
TVS = diode:SUPPRESSOR-: Suppressor diode
U1 = SmartPrj:ATSAM3X/A
U3-U6 = adum3221:ADUM3221BRZ: Dual Channel Gate Driver; MPN: ADUM3221BRZ; OC_FARNELL: 1897122; OC_NEWARK: 39T6549; PACKAGE: SOIC-8; SUPPLIER: ANALOG DEVICES
U7 = EPROM:CK_CUSTOM_M24M02-DRMN6TP
U8 = Traco:TRACO
U9 = Traco:TSR-1
U10 = microbuilder:LM1117: LM1117 Voltage Regulator LM1117 Adjustable Voltage regulator [Digikey: LM1117IMP-ADJDKR-ND] LM1117 3.3V Voltage regulator [AP1117E33GDIDKR-ND] LM1117 5.0V Voltage regulator [AP1117E50GDIDKR-ND] SOT223-REFLOW - SOT223 package for solder paste/reflow ovens SOT223-WAVE - SOT223 package for hand-soldering (larger pads) Note: For the fixed-voltage regulators, simply set the ADJ pin to GND.
U11 U12 U24 = collin:ADE7913
U$1 = collin:CINCON5V
U$2 = CINCH:581_01_48_005_S
U$3 = crystal:ASE: 3.3Vdc CMOS SMD CRYSTAL CLOCK OSCILLATOR SOurce: www.abracon.com; OC_FARNELL: unknown; OC_NEWARK: unknown
U$4 = collin:BLE_SPI
X1 = con-berg:PN61729-S: BERG USB connector; OC_FARNELL: unknown; OC_NEWARK: unknown
Y1 = SmartPrj:CRYSTAL-3.2-2.5
Y2 = Arduino_Wifi_shield_v018_tG:ARDUINO_WIFI_SHIELD_V018_TG_RESONATOR_EPSON_FC_145
ZEN = diode:ZENER-DIODE: Z-Diode

## Net classes
0 default: width 0.203 mm
1 USB: drill 0.406 mm, clearance 0.203 mm to class 0, clearance 0.406 mm
2 gnd: width 0.305 mm, drill 0.406 mm, clearance 0.203 mm to class 0, clearance 0.203 mm
3 usbvcc: width 0.61 mm, drill 0.508 mm, clearance 0.203 mm to class 0, clearance 0.254 mm